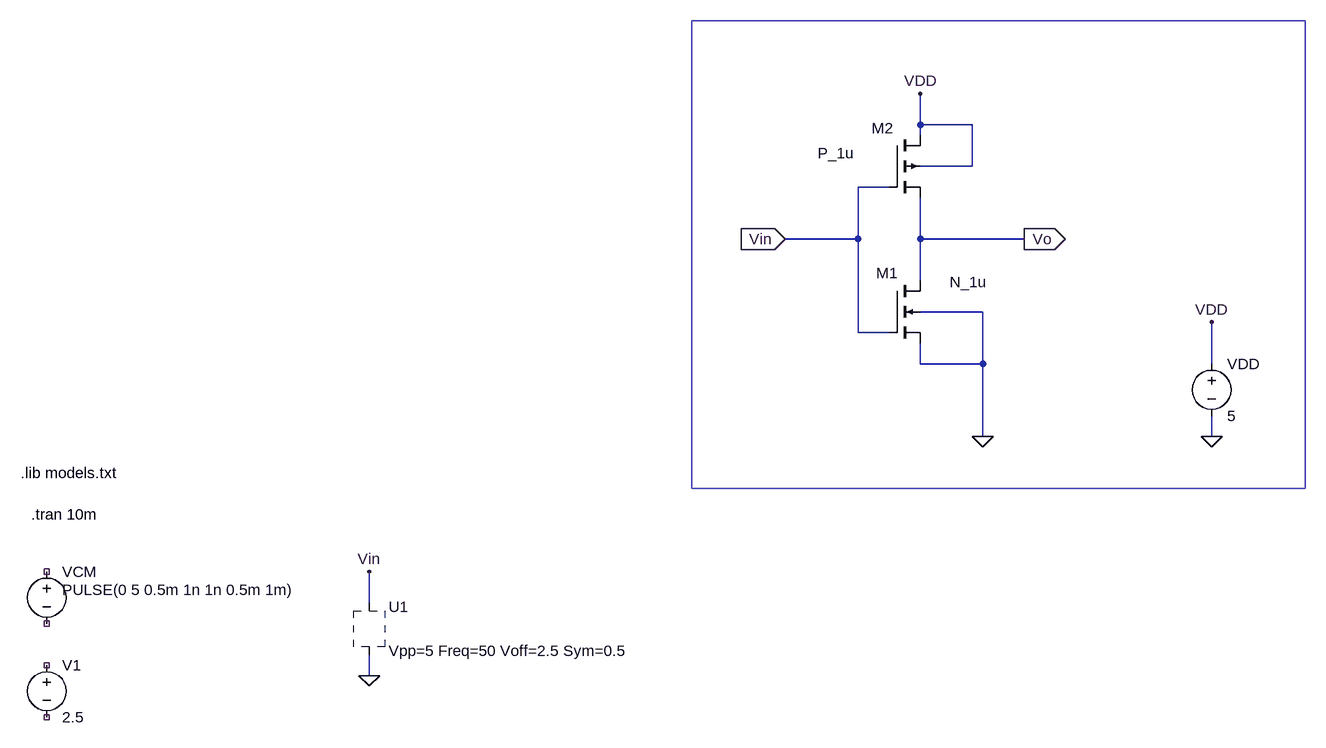
[diagram p0: schematic TP1_ej1.asc]
TP1_ej1.asc, the LTspice schematic file:
Version 4.1
SHEET 1 1140 816
WIRE 544 -112 544 -160
WIRE 624 -112 544 -112
WIRE 544 -96 544 -112
WIRE 624 -48 624 -112
WIRE 624 -48 544 -48
WIRE 496 -16 448 -16
WIRE 448 64 448 -16
WIRE 448 64 336 64
WIRE 544 64 544 0
WIRE 704 64 544 64
WIRE 544 128 544 64
WIRE 640 176 544 176
WIRE 448 208 448 64
WIRE 496 208 448 208
WIRE 544 256 544 224
WIRE 640 256 640 176
WIRE 640 256 544 256
WIRE 992 256 992 192
WIRE 640 368 640 256
WIRE 992 368 992 336
WIRE -304 624 -304 576
WIRE -304 736 -304 704
FLAG 992 368 0
FLAG 992 192 VDD
FLAG 336 64 Vin
IOPIN 336 64 In
FLAG -304 736 0
FLAG 640 368 0
FLAG 544 -160 VDD
FLAG 704 64 Vo
IOPIN 704 64 Out
FLAG -304 576 Vin
SYMBOL voltage 992 240 R0
SYMATTR InstName VDD
SYMATTR Value 5
SYMBOL voltage -800 560 R0
WINDOW 123 24 92 Left 2
WINDOW 39 0 0 Left 0
WINDOW 3 24 44 Left 2
SYMATTR Value PULSE(0 5 0.5m 1n 1n 0.5m 1m)
SYMATTR InstName VCM
SYMBOL nmos4 496 128 R0
WINDOW 0 -20 -12 Left 2
WINDOW 3 93 2 Left 2
SYMATTR InstName M1
SYMATTR Value N_1u
SYMATTR Value2 l=1u w=2u
SYMBOL pmos4 496 -96 R0
WINDOW 0 -27 -11 Left 2
WINDOW 3 -110 28 Left 2
SYMATTR InstName M2
SYMATTR Value2 l=1u w=6u
SYMATTR Value P_1u
SYMBOL TCLib\\triangular -304 672 R0
SYMATTR Value Vpp=5 Freq=50 Voff=2.5 Sym=0.5
SYMATTR InstName U1
SYMBOL voltage -800 704 R0
SYMATTR InstName V1
SYMATTR Value 2.5
TEXT -840 424 Left 2 !.lib models.txt
TEXT -824 488 Left 2 !.tran 10m
RECTANGLE Normal 1136 448 192 -272

The netlist it stands for:
* TP1_ej1.asc
VDD VDD 0 5
VCM NC_01 NC_02 PULSE(0 5 0.5m 1n 1n 0.5m 1m)
M1 Vo Vin 0 0 N_1u l=1u w=2u
M2 VDD Vin Vo VDD P_1u l=1u w=6u
* U1: Vpp=5 Freq=50 Voff=2.5 Sym=0.5 (symbol TCLib\triangular not available, pin order unknown); nets seen at it: 0, Vin
V1 NC_03 NC_04 2.5
.model NMOS NMOS
.model PMOS PMOS
.lib standard.mos
.lib models.txt
.tran 10m
.backanno
.end